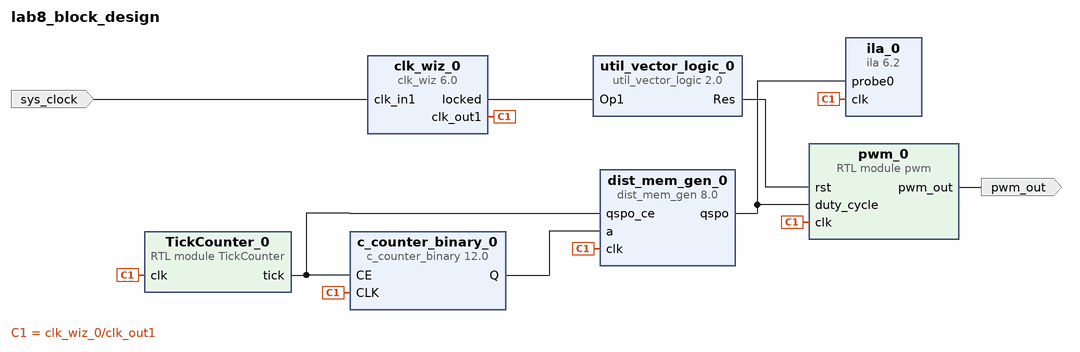
[diagram p0: block diagram of the top level]
# Vivado block design lab8_block_design, xc7a35ticsg324-1L, Vivado 2022.2_AR000035739
create_bd_design lab8_block_design

create_bd_port -dir I -type clk sys_clock
set_property -dict {CONFIG.FREQ_HZ 100000000 CONFIG.PHASE 0.0} [get_bd_ports sys_clock]
create_bd_port -dir O -type data pwm_out

create_bd_cell -type ip -vlnv xilinx.com:ip:dist_mem_gen:8.0 dist_mem_gen_0
set_property -dict [list \
  CONFIG.coefficient_file ../../../../../lab8_block_design_dist_mem_gen_0_0.coe \
  CONFIG.data_width 8 \
  CONFIG.default_data_radix 10 \
  CONFIG.depth 128 \
  CONFIG.input_options registered \
  CONFIG.memory_type rom \
  CONFIG.output_options registered \
  CONFIG.single_port_output_clock_enable true \
] [get_bd_cells dist_mem_gen_0]
create_bd_cell -type ip -vlnv xilinx.com:ip:c_counter_binary:12.0 c_counter_binary_0
set_property -dict {CONFIG.CE true CONFIG.Output_Width 7} [get_bd_cells c_counter_binary_0]
create_bd_cell -type ip -vlnv xilinx.com:ip:ila:6.2 ila_0
set_property -dict {CONFIG.C_DATA_DEPTH 4096 CONFIG.C_MONITOR_TYPE Native CONFIG.C_PROBE0_WIDTH 8} [get_bd_cells ila_0]
create_bd_cell -type module -reference pwm pwm_0
set_property -dict {CONFIG.clk_cnt_len 128 CONFIG.pwm_bits 8} [get_bd_cells pwm_0]
create_bd_cell -type ip -vlnv xilinx.com:ip:util_vector_logic:2.0 util_vector_logic_0
set_property -dict {CONFIG.C_OPERATION not CONFIG.C_SIZE 1} [get_bd_cells util_vector_logic_0]
create_bd_cell -type module -reference TickCounter TickCounter_0
set_property -dict {CONFIG.MAX 32640} [get_bd_cells TickCounter_0]
create_bd_cell -type ip -vlnv xilinx.com:ip:clk_wiz:6.0 clk_wiz_0
set_property -dict [list \
  CONFIG.CLKOUT1_JITTER 130.958 \
  CONFIG.CLKOUT1_PHASE_ERROR 98.575 \
  CONFIG.CLKOUT2_JITTER 251.196 \
  CONFIG.CLKOUT2_PHASE_ERROR 114.212 \
  CONFIG.CLKOUT2_REQUESTED_OUT_FREQ 100.000 \
  CONFIG.CLKOUT2_USED false \
  CONFIG.CLK_IN1_BOARD_INTERFACE sys_clock \
  CONFIG.MMCM_CLKFBOUT_MULT_F 10.000 \
  CONFIG.MMCM_CLKOUT0_DIVIDE_F 10.000 \
  CONFIG.MMCM_CLKOUT1_DIVIDE 1 \
  CONFIG.NUM_OUT_CLKS 1 \
  CONFIG.USE_BOARD_FLOW true \
  CONFIG.USE_LOCKED true \
  CONFIG.USE_RESET false \
] [get_bd_cells clk_wiz_0]

# ---- connections ----

connect_bd_net [get_bd_pins TickCounter_0/tick] [get_bd_pins c_counter_binary_0/CE] [get_bd_pins dist_mem_gen_0/qspo_ce]
connect_bd_net [get_bd_pins c_counter_binary_0/Q] [get_bd_pins dist_mem_gen_0/a]
connect_bd_net [get_bd_pins clk_wiz_0/clk_out1] \
  [get_bd_pins c_counter_binary_0/CLK] [get_bd_pins dist_mem_gen_0/clk] [get_bd_pins ila_0/clk] [get_bd_pins pwm_0/clk] \
  [get_bd_pins TickCounter_0/clk]
connect_bd_net [get_bd_pins clk_wiz_0/locked] [get_bd_pins util_vector_logic_0/Op1]
connect_bd_net [get_bd_pins dist_mem_gen_0/qspo] [get_bd_pins ila_0/probe0] [get_bd_pins pwm_0/duty_cycle]
connect_bd_net [get_bd_pins pwm_0/pwm_out] [get_bd_ports pwm_out]
connect_bd_net [get_bd_ports sys_clock] [get_bd_pins clk_wiz_0/clk_in1]
connect_bd_net [get_bd_pins util_vector_logic_0/Res] [get_bd_pins pwm_0/rst]

validate_bd_design
save_bd_design
